# EAGLE design modul_pt100 (EAGLE 7.4.0)

## Sheet 1 of 3
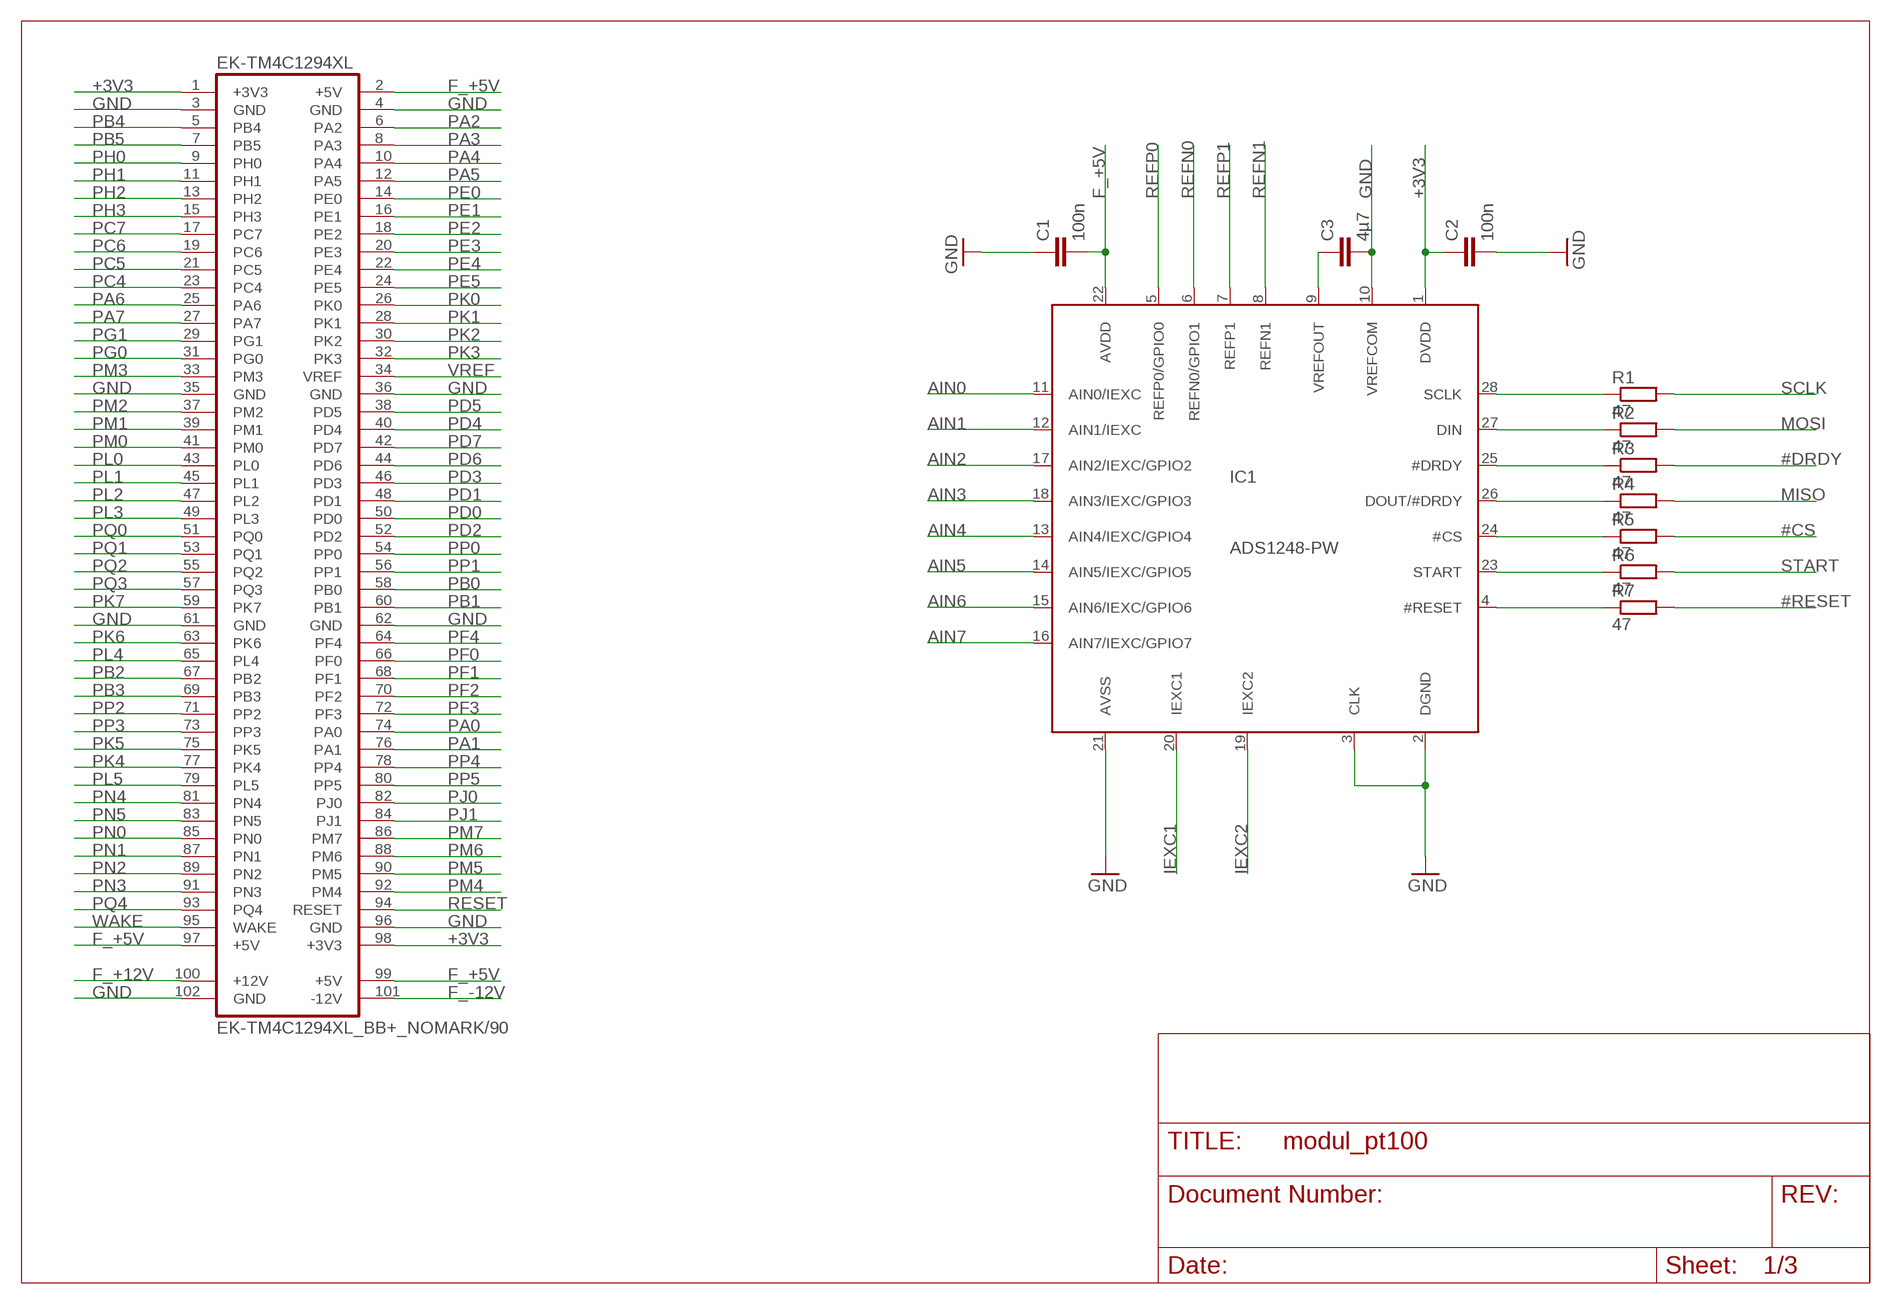
[diagram p0: schematic, sheet 1]

### Parts
C1  100n  C-EUC0805  [C0805]
C2  100n  C-EUC0805  [C0805]
C3  4µ7  C-EUC0805  [C0805]
EK-TM4C1294XL  EK-TM4C1294XL_BB+_NOMARK/90  [EK-TM4C1294XL_BB+_NOMARK/90]
IC1  ADS1248-PW  [TSSOP28]
R1  47  R-EU_R0805  [R0805]
R2  47  R-EU_R0805  [R0805]
R3  47  R-EU_R0805  [R0805]
R4  47  R-EU_R0805  [R0805]
R5  47  R-EU_R0805  [R0805]
R6  47  R-EU_R0805  [R0805]
R7  47  R-EU_R0805  [R0805]

### Nets
#CS: R5.2 ; also sheet 3
#DRDY: R3.2 ; also sheet 3
#RESET: R7.2 ; also sheet 3
+3V3: C2.1 EK-TM4C1294XL.1(+3V3) EK-TM4C1294XL.98(+3V3) IC1.1(DVDD) ; also sheet 3
AIN0: IC1.11(AIN0/IEXC) ; also sheet 2
AIN1: IC1.12(AIN1/IEXC) ; also sheet 2
AIN2: IC1.17(AIN2/IEXC/GPIO2) ; also sheet 2
AIN3: IC1.18(AIN3/IEXC/GPIO3) ; also sheet 2
AIN4: IC1.13(AIN4/IEXC/GPIO4)
AIN5: IC1.14(AIN5/IEXC/GPIO5)
AIN6: IC1.15(AIN6/IEXC/GPIO6)
AIN7: IC1.16(AIN7/IEXC/GPIO7)
F_+5V: C1.2 EK-TM4C1294XL.2(+5V) EK-TM4C1294XL.97(+5V) EK-TM4C1294XL.99(+5V) IC1.22(AVDD) ; also sheet 2,3
F_+12V: EK-TM4C1294XL.100(+12V) ; also sheet 3
F_-12V: EK-TM4C1294XL.101(-12V) ; also sheet 3
GND: C1.1 C2.2 C3.2 EK-TM4C1294XL.3(GND) EK-TM4C1294XL.4(GND) EK-TM4C1294XL.35(GND) EK-TM4C1294XL.36(GND) EK-TM4C1294XL.61(GND) EK-TM4C1294XL.62(GND) EK-TM4C1294XL.96(GND) EK-TM4C1294XL.102(GND) IC1.2(DGND) IC1.3(CLK) IC1.10(VREFCOM) IC1.21(AVSS) ; also sheet 2,3
IEXC1: IC1.20(IEXC1) ; also sheet 2
IEXC2: IC1.19(IEXC2) ; also sheet 2
MISO: R4.2 ; also sheet 2
MOSI: R2.2 ; also sheet 2
N$1: C3.1 IC1.9(VREFOUT)
N$2: IC1.28(SCLK) R1.1
N$3: IC1.27(DIN) R2.1
N$4: IC1.25(#DRDY) R3.1
N$5: IC1.26(DOUT/#DRDY) R4.1
N$6: IC1.24(#CS) R5.1
N$7: IC1.23(START) R6.1
N$8: IC1.4(#RESET) R7.1
PA0: EK-TM4C1294XL.74(PA0) ; also sheet 3
PA1: EK-TM4C1294XL.76(PA1) ; also sheet 3
PA2: EK-TM4C1294XL.6(PA2) ; also sheet 2,3
PA3: EK-TM4C1294XL.8(PA3) ; also sheet 3
PA4: EK-TM4C1294XL.10(PA4) ; also sheet 2,3
PA5: EK-TM4C1294XL.12(PA5) ; also sheet 2,3
PA6: EK-TM4C1294XL.25(PA6) ; also sheet 3
PA7: EK-TM4C1294XL.27(PA7) ; also sheet 3
PB0: EK-TM4C1294XL.58(PB0) ; also sheet 3
PB1: EK-TM4C1294XL.60(PB1) ; also sheet 3
PB2: EK-TM4C1294XL.67(PB2) ; also sheet 3
PB3: EK-TM4C1294XL.69(PB3) ; also sheet 3
PB4: EK-TM4C1294XL.5(PB4) ; also sheet 3
PB5: EK-TM4C1294XL.7(PB5) ; also sheet 2,3
PC4: EK-TM4C1294XL.23(PC4) ; also sheet 3
PC5: EK-TM4C1294XL.21(PC5) ; also sheet 3
PC6: EK-TM4C1294XL.19(PC6) ; also sheet 3
PC7: EK-TM4C1294XL.17(PC7) ; also sheet 3
PD0: EK-TM4C1294XL.50(PD0) ; also sheet 2,3
PD1: EK-TM4C1294XL.48(PD1) ; also sheet 2,3
PD2: EK-TM4C1294XL.52(PD2) ; also sheet 3
PD3: EK-TM4C1294XL.46(PD3) ; also sheet 2,3
PD4: EK-TM4C1294XL.40(PD4) ; also sheet 3
PD5: EK-TM4C1294XL.38(PD5) ; also sheet 3
PD6: EK-TM4C1294XL.44(PD6) ; also sheet 3
PD7: EK-TM4C1294XL.42(PD7) ; also sheet 3
PE0: EK-TM4C1294XL.14(PE0) ; also sheet 3
PE1: EK-TM4C1294XL.16(PE1) ; also sheet 3
PE2: EK-TM4C1294XL.18(PE2) ; also sheet 3
PE3: EK-TM4C1294XL.20(PE3) ; also sheet 3
PE4: EK-TM4C1294XL.22(PE4) ; also sheet 2,3
PE5: EK-TM4C1294XL.24(PE5) ; also sheet 2,3
PF0: EK-TM4C1294XL.66(PF0) ; also sheet 3
PF1: EK-TM4C1294XL.68(PF1) ; also sheet 3
PF2: EK-TM4C1294XL.70(PF2) ; also sheet 3
PF3: EK-TM4C1294XL.72(PF3) ; also sheet 3
PF4: EK-TM4C1294XL.64(PF4) ; also sheet 3
PG0: EK-TM4C1294XL.31(PG0) ; also sheet 3
PG1: EK-TM4C1294XL.29(PG1) ; also sheet 3
PH0: EK-TM4C1294XL.9(PH0) ; also sheet 3
PH1: EK-TM4C1294XL.11(PH1) ; also sheet 3
PH2: EK-TM4C1294XL.13(PH2) ; also sheet 3
PH3: EK-TM4C1294XL.15(PH3) ; also sheet 3
PJ0: EK-TM4C1294XL.82(PJ0) ; also sheet 3
PJ1: EK-TM4C1294XL.84(PJ1) ; also sheet 3
PK0: EK-TM4C1294XL.26(PK0) ; also sheet 3
PK1: EK-TM4C1294XL.28(PK1) ; also sheet 3
PK2: EK-TM4C1294XL.30(PK2) ; also sheet 3
PK3: EK-TM4C1294XL.32(PK3) ; also sheet 3
PK4: EK-TM4C1294XL.77(PK4) ; also sheet 3
PK5: EK-TM4C1294XL.75(PK5) ; also sheet 3
PK6: EK-TM4C1294XL.63(PK6) ; also sheet 3
PK7: EK-TM4C1294XL.59(PK7) ; also sheet 3
PL0: EK-TM4C1294XL.43(PL0) ; also sheet 3
PL1: EK-TM4C1294XL.45(PL1) ; also sheet 3
PL2: EK-TM4C1294XL.47(PL2) ; also sheet 3
PL3: EK-TM4C1294XL.49(PL3) ; also sheet 3
PL4: EK-TM4C1294XL.65(PL4) ; also sheet 3
PL5: EK-TM4C1294XL.79(PL5) ; also sheet 3
PM0: EK-TM4C1294XL.41(PM0) ; also sheet 3
PM1: EK-TM4C1294XL.39(PM1) ; also sheet 3
PM2: EK-TM4C1294XL.37(PM2) ; also sheet 3
PM3: EK-TM4C1294XL.33(PM3) ; also sheet 3
PM4: EK-TM4C1294XL.92(PM4) ; also sheet 3
PM5: EK-TM4C1294XL.90(PM5) ; also sheet 3
PM6: EK-TM4C1294XL.88(PM6) ; also sheet 3
PM7: EK-TM4C1294XL.86(PM7) ; also sheet 3
PN0: EK-TM4C1294XL.85(PN0) ; also sheet 3
PN1: EK-TM4C1294XL.87(PN1) ; also sheet 3
PN2: EK-TM4C1294XL.89(PN2) ; also sheet 3
PN3: EK-TM4C1294XL.91(PN3) ; also sheet 3
PN4: EK-TM4C1294XL.81(PN4) ; also sheet 3
PN5: EK-TM4C1294XL.83(PN5) ; also sheet 3
PP0: EK-TM4C1294XL.54(PP0) ; also sheet 3
PP1: EK-TM4C1294XL.56(PP1) ; also sheet 3
PP2: EK-TM4C1294XL.71(PP2) ; also sheet 3
PP3: EK-TM4C1294XL.73(PP3) ; also sheet 3
PP4: EK-TM4C1294XL.78(PP4) ; also sheet 3
PP5: EK-TM4C1294XL.80(PP5) ; also sheet 3
PQ0: EK-TM4C1294XL.51(PQ0) ; also sheet 2,3
PQ1: EK-TM4C1294XL.53(PQ1) ; also sheet 3
PQ2: EK-TM4C1294XL.55(PQ2) ; also sheet 2,3
PQ3: EK-TM4C1294XL.57(PQ3) ; also sheet 2,3
PQ4: EK-TM4C1294XL.93(PQ4) ; also sheet 3
REFN0: IC1.6(REFN0/GPIO1) ; also sheet 2
REFN1: IC1.8(REFN1) ; also sheet 2
REFP0: IC1.5(REFP0/GPIO0) ; also sheet 2
REFP1: IC1.7(REFP1) ; also sheet 2
RESET: EK-TM4C1294XL.94(RESET) ; also sheet 3
SCLK: R1.2 ; also sheet 2
START: R6.2 ; also sheet 3
VREF: EK-TM4C1294XL.34(VREF) ; also sheet 3
WAKE: EK-TM4C1294XL.95(WAKE) ; also sheet 3

## Sheet 2 of 3
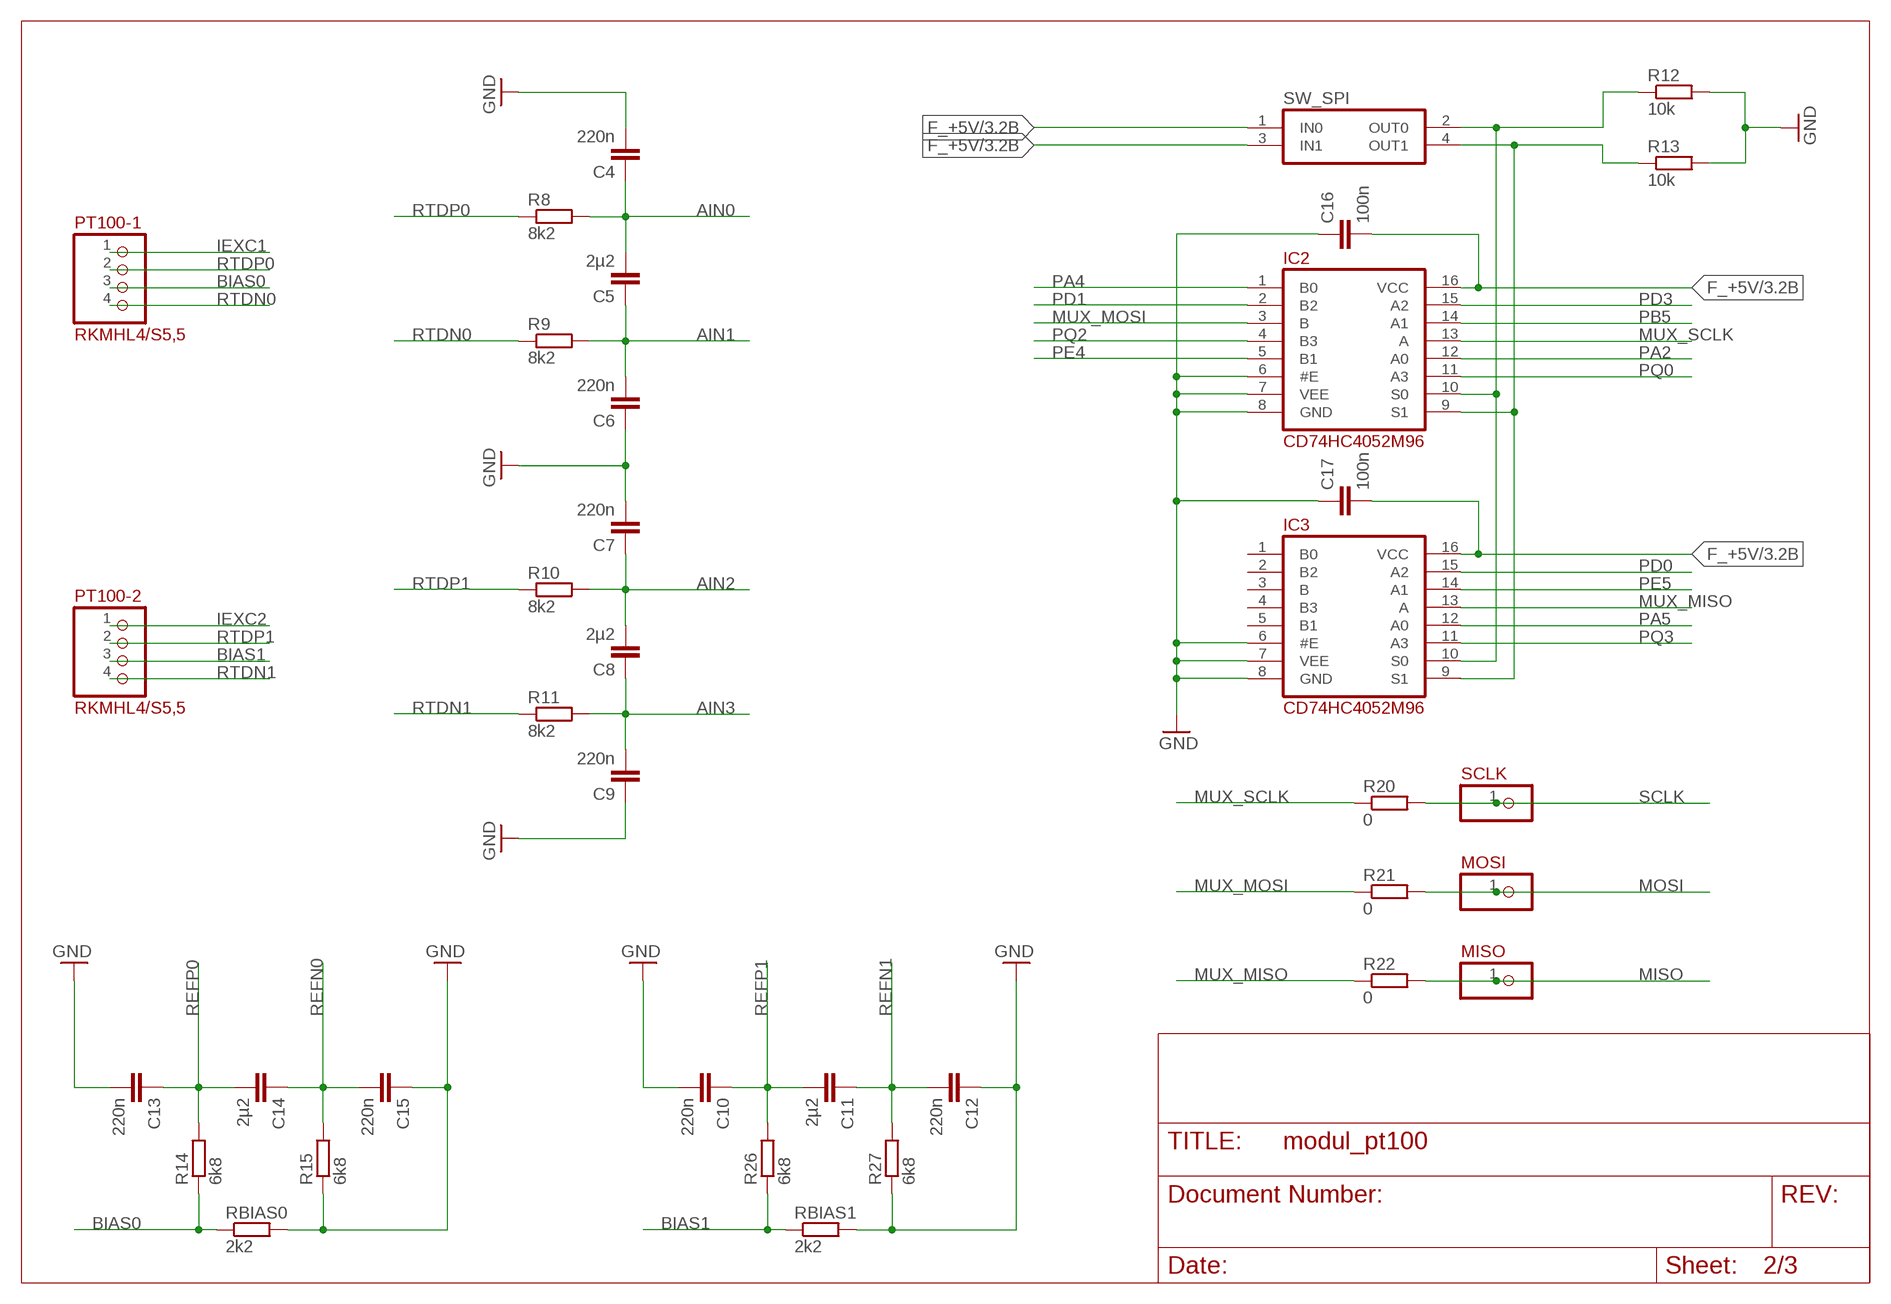
[diagram p1: schematic, sheet 2]

### Parts
C4  220n  C-EUC0805  [C0805]
C5  2µ2  C-EUC0805  [C0805]
C6  220n  C-EUC0805  [C0805]
C7  220n  C-EUC0805  [C0805]
C8  2µ2  C-EUC0805  [C0805]
C9  220n  C-EUC0805  [C0805]
C10  220n  C-EUC0805  [C0805]
C11  2µ2  C-EUC0805  [C0805]
C12  220n  C-EUC0805  [C0805]
C13  220n  C-EUC0805  [C0805]
C14  2µ2  C-EUC0805  [C0805]
C15  220n  C-EUC0805  [C0805]
C16  100n  C-EUC0805  [C0805]
C17  100n  C-EUC0805  [C0805]
IC2  CD74HC4052M96  [SOIC16_D]
IC3  CD74HC4052M96  [SOIC16_D]
MISO  PINH-1X1  [1X1]
MOSI  PINH-1X1  [1X1]
PT100-1  RKMHL4/S5,5  [RKMHL4/S5,5]
PT100-2  RKMHL4/S5,5  [RKMHL4/S5,5]
R8  8k2  R-EU_R0805  [R0805]
R9  8k2  R-EU_R0805  [R0805]
R10  8k2  R-EU_R0805  [R0805]
R11  8k2  R-EU_R0805  [R0805]
R12  10k  R-EU_R0805  [R0805]
R13  10k  R-EU_R0805  [R0805]
R14  6k8  R-EU_R0805  [R0805]
R15  6k8  R-EU_R0805  [R0805]
R20  0  R-EU_R0805  [R0805]
R21  0  R-EU_R0805  [R0805]
R22  0  R-EU_R0805  [R0805]
R26  6k8  R-EU_R0805  [R0805]
R27  6k8  R-EU_R0805  [R0805]
RBIAS0  2k2  R-EU_R0805  [R0805]
RBIAS1  2k2  R-EU_R0805  [R0805]
SCLK  PINH-1X1  [1X1]
SW_SPI  NT02  [NT02]

### Nets
AIN0: C4.1 C5.2 R8.2 ; also sheet 1
AIN1: C5.1 C6.2 R9.2 ; also sheet 1
AIN2: C7.1 C8.2 R10.2 ; also sheet 1
AIN3: C8.1 C9.2 R11.2 ; also sheet 1
BIAS0: PT100-1.3 R14.1 RBIAS0.1
BIAS1: PT100-2.3 R26.1 RBIAS1.1
F_+5V: C16.2 C17.2 IC2.16(VCC) IC3.16(VCC) SW_SPI.1(IN0) SW_SPI.3(IN1) ; also sheet 1,3
GND: C4.2 C6.1 C7.2 C9.1 C10.2 C12.1 C13.2 C15.1 C16.1 C17.1 IC2.6(#E) IC2.7(VEE) IC2.8(GND) IC3.6(#E) IC3.7(VEE) IC3.8(GND) R12.2 R13.2 R15.1 R27.1 RBIAS0.2 RBIAS1.2 ; also sheet 1,3
IEXC1: PT100-1.1 ; also sheet 1
IEXC2: PT100-2.1 ; also sheet 1
MISO: MISO.1 R22.2 ; also sheet 1
MOSI: MOSI.1 R21.2 ; also sheet 1
MUX_MISO: IC3.13(A) R22.1
MUX_MOSI: IC2.3(B) R21.1
MUX_SCLK: IC2.13(A) R20.1
N$16: IC2.10(S0) IC3.10(S0) R12.1 SW_SPI.2(OUT0)
N$17: IC2.9(S1) IC3.9(S1) R13.1 SW_SPI.4(OUT1)
PA2: IC2.12(A0) ; also sheet 1,3
PA4: IC2.1(B0) ; also sheet 1,3
PA5: IC3.12(A0) ; also sheet 1,3
PB5: IC2.14(A1) ; also sheet 1,3
PD0: IC3.15(A2) ; also sheet 1,3
PD1: IC2.2(B2) ; also sheet 1,3
PD3: IC2.15(A2) ; also sheet 1,3
PE4: IC2.5(B1) ; also sheet 1,3
PE5: IC3.14(A1) ; also sheet 1,3
PQ0: IC2.11(A3) ; also sheet 1,3
PQ2: IC2.4(B3) ; also sheet 1,3
PQ3: IC3.11(A3) ; also sheet 1,3
REFN0: C14.1 C15.2 R15.2 ; also sheet 1
REFN1: C11.1 C12.2 R27.2 ; also sheet 1
REFP0: C13.1 C14.2 R14.2 ; also sheet 1
REFP1: C10.1 C11.2 R26.2 ; also sheet 1
RTDN0: PT100-1.4 R9.1
RTDN1: PT100-2.4 R11.1
RTDP0: PT100-1.2 R8.1
RTDP1: PT100-2.2 R10.1
SCLK: R20.2 SCLK.1 ; also sheet 1
Unconnected: IC3.1(B0) IC3.2(B2) IC3.3(B) IC3.4(B3) IC3.5(B1)

## Sheet 3 of 3
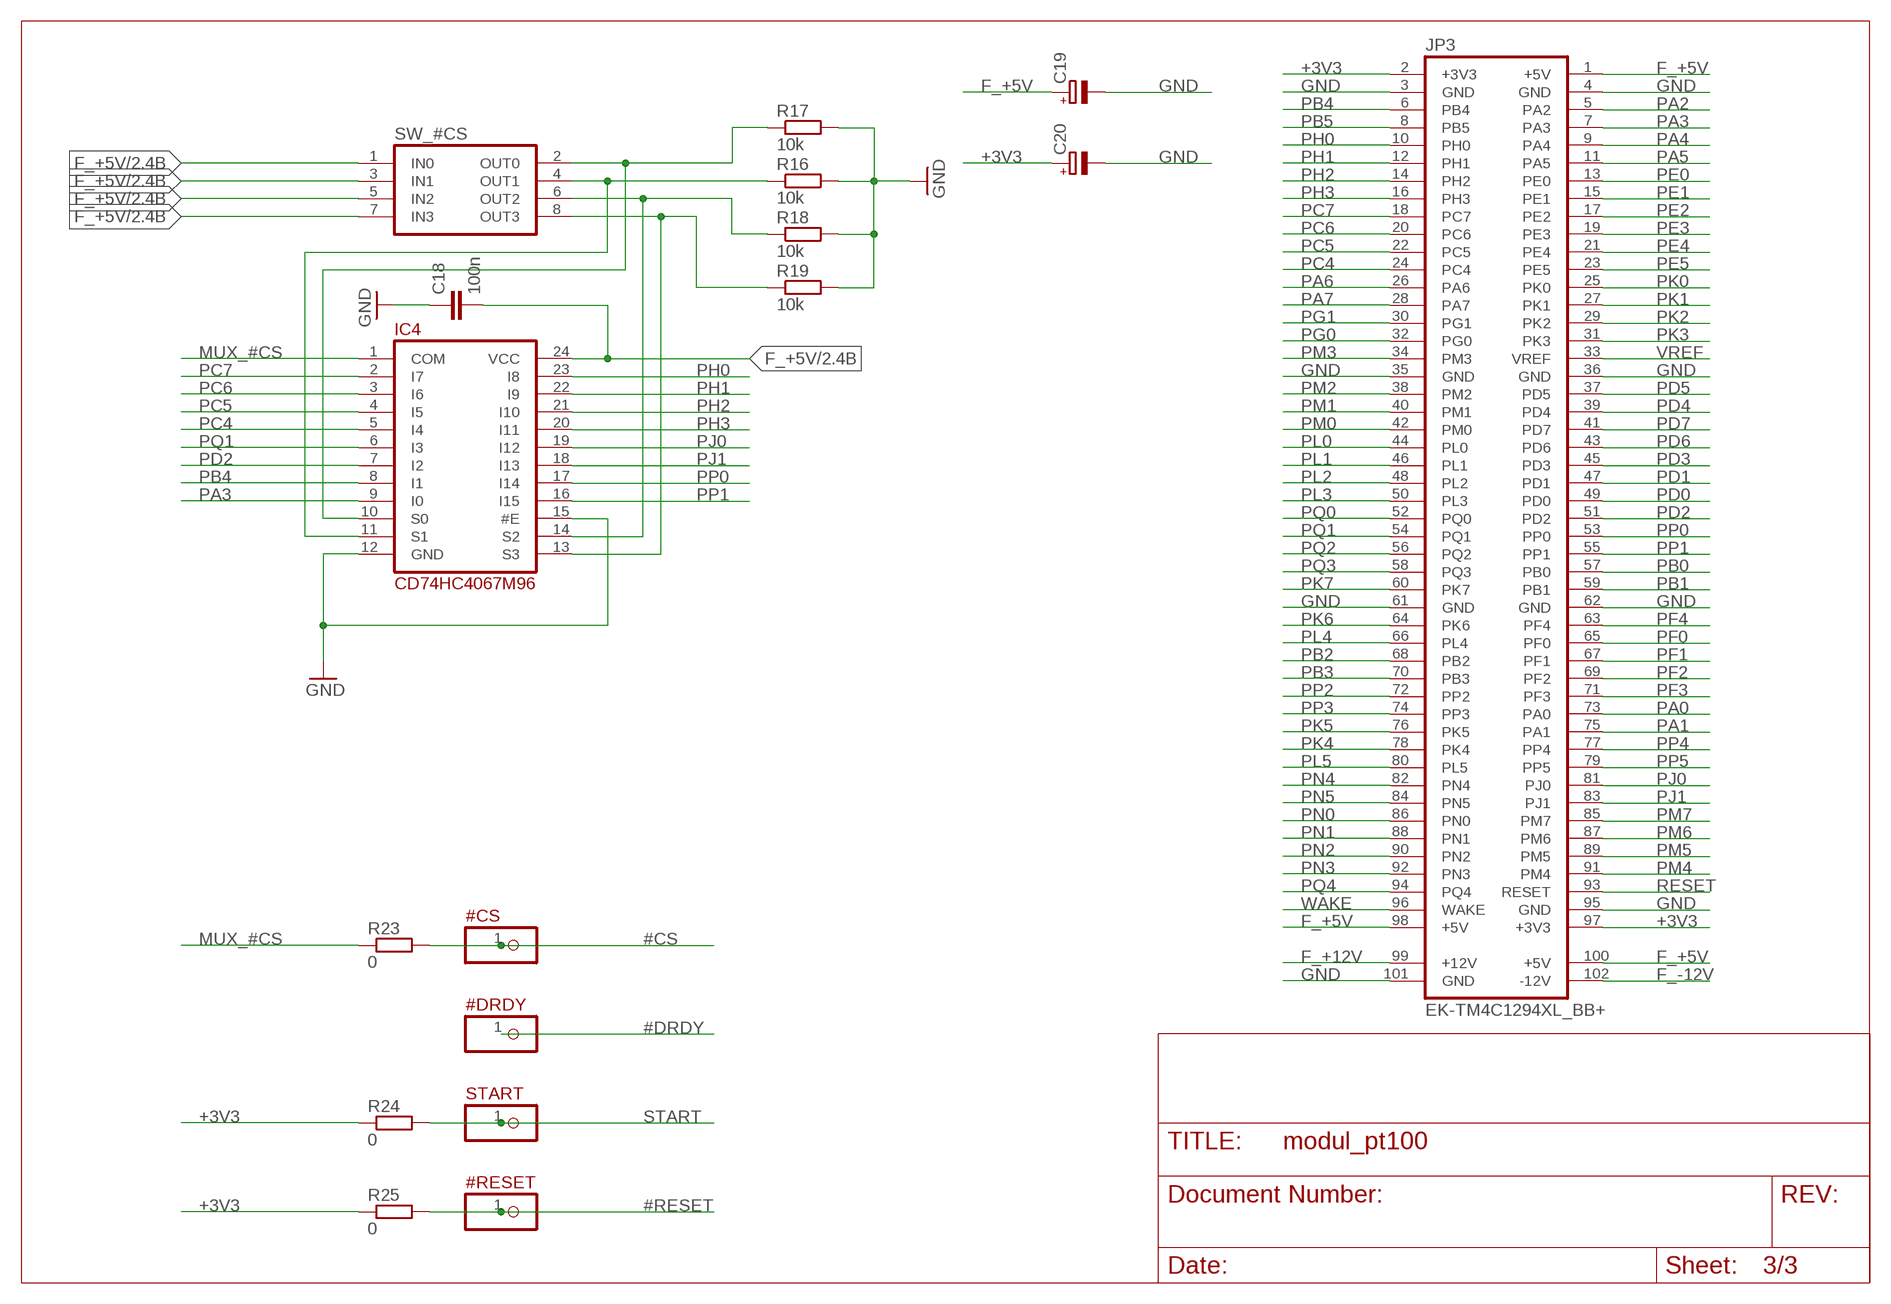
[diagram p2: schematic, sheet 3]

### Parts
#CS  PINH-1X1  [1X1]
#DRDY  PINH-1X1  [1X1]
#RESET  PINH-1X1  [1X1]
C18  100n  C-EUC0805  [C0805]
C19  CPOL-EUE2.5-6  [E2,5-6]
C20  CPOL-EUE2.5-6  [E2,5-6]
IC4  CD74HC4067M96  [SOIC24_DW]
JP3  EK-TM4C1294XL_BB+  [EK-TM4C1294XL_BB+]
R16  10k  R-EU_R0805  [R0805]
R17  10k  R-EU_R0805  [R0805]
R18  10k  R-EU_R0805  [R0805]
R19  10k  R-EU_R0805  [R0805]
R23  0  R-EU_R0805  [R0805]
R24  0  R-EU_R0805  [R0805]
R25  0  R-EU_R0805  [R0805]
START  PINH-1X1  [1X1]
SW_#CS  NT04  [NT04]

### Nets
#CS: #CS.1 R23.2 ; also sheet 1
#DRDY: #DRDY.1 ; also sheet 1
#RESET: #RESET.1 R25.2 ; also sheet 1
+3V3: C20.+ JP3.2(+3V3) JP3.97(+3V3) R24.1 R25.1 ; also sheet 1
F_+5V: C18.2 C19.+ IC4.24(VCC) JP3.1(+5V) JP3.98(+5V) JP3.100(+5V) SW_#CS.1(IN0) SW_#CS.3(IN1) SW_#CS.5(IN2) SW_#CS.7(IN3) ; also sheet 1,2
F_+12V: JP3.99(+12V) ; also sheet 1
F_-12V: JP3.102(-12V) ; also sheet 1
GND: C18.1 C19.- C20.- IC4.12(GND) IC4.15(#E) JP3.3(GND) JP3.4(GND) JP3.35(GND) JP3.36(GND) JP3.61(GND) JP3.62(GND) JP3.95(GND) JP3.101(GND) R16.2 R17.2 R18.2 R19.2 ; also sheet 1,2
MUX_#CS: IC4.1(COM) R23.1
N$10: IC4.11(S1) R16.1 SW_#CS.4(OUT1)
N$12: IC4.10(S0) R17.1 SW_#CS.2(OUT0)
N$18: IC4.14(S2) R18.1 SW_#CS.6(OUT2)
N$24: IC4.13(S3) R19.1 SW_#CS.8(OUT3)
PA0: JP3.73(PA0) ; also sheet 1
PA1: JP3.75(PA1) ; also sheet 1
PA2: JP3.5(PA2) ; also sheet 1,2
PA3: IC4.9(I0) JP3.7(PA3) ; also sheet 1
PA4: JP3.9(PA4) ; also sheet 1,2
PA5: JP3.11(PA5) ; also sheet 1,2
PA6: JP3.26(PA6) ; also sheet 1
PA7: JP3.28(PA7) ; also sheet 1
PB0: JP3.57(PB0) ; also sheet 1
PB1: JP3.59(PB1) ; also sheet 1
PB2: JP3.68(PB2) ; also sheet 1
PB3: JP3.70(PB3) ; also sheet 1
PB4: IC4.8(I1) JP3.6(PB4) ; also sheet 1
PB5: JP3.8(PB5) ; also sheet 1,2
PC4: IC4.5(I4) JP3.24(PC4) ; also sheet 1
PC5: IC4.4(I5) JP3.22(PC5) ; also sheet 1
PC6: IC4.3(I6) JP3.20(PC6) ; also sheet 1
PC7: IC4.2(I7) JP3.18(PC7) ; also sheet 1
PD0: JP3.49(PD0) ; also sheet 1,2
PD1: JP3.47(PD1) ; also sheet 1,2
PD2: IC4.7(I2) JP3.51(PD2) ; also sheet 1
PD3: JP3.45(PD3) ; also sheet 1,2
PD4: JP3.39(PD4) ; also sheet 1
PD5: JP3.37(PD5) ; also sheet 1
PD6: JP3.43(PD6) ; also sheet 1
PD7: JP3.41(PD7) ; also sheet 1
PE0: JP3.13(PE0) ; also sheet 1
PE1: JP3.15(PE1) ; also sheet 1
PE2: JP3.17(PE2) ; also sheet 1
PE3: JP3.19(PE3) ; also sheet 1
PE4: JP3.21(PE4) ; also sheet 1,2
PE5: JP3.23(PE5) ; also sheet 1,2
PF0: JP3.65(PF0) ; also sheet 1
PF1: JP3.67(PF1) ; also sheet 1
PF2: JP3.69(PF2) ; also sheet 1
PF3: JP3.71(PF3) ; also sheet 1
PF4: JP3.63(PF4) ; also sheet 1
PG0: JP3.32(PG0) ; also sheet 1
PG1: JP3.30(PG1) ; also sheet 1
PH0: IC4.23(I8) JP3.10(PH0) ; also sheet 1
PH1: IC4.22(I9) JP3.12(PH1) ; also sheet 1
PH2: IC4.21(I10) JP3.14(PH2) ; also sheet 1
PH3: IC4.20(I11) JP3.16(PH3) ; also sheet 1
PJ0: IC4.19(I12) JP3.81(PJ0) ; also sheet 1
PJ1: IC4.18(I13) JP3.83(PJ1) ; also sheet 1
PK0: JP3.25(PK0) ; also sheet 1
PK1: JP3.27(PK1) ; also sheet 1
PK2: JP3.29(PK2) ; also sheet 1
PK3: JP3.31(PK3) ; also sheet 1
PK4: JP3.78(PK4) ; also sheet 1
PK5: JP3.76(PK5) ; also sheet 1
PK6: JP3.64(PK6) ; also sheet 1
PK7: JP3.60(PK7) ; also sheet 1
PL0: JP3.44(PL0) ; also sheet 1
PL1: JP3.46(PL1) ; also sheet 1
PL2: JP3.48(PL2) ; also sheet 1
PL3: JP3.50(PL3) ; also sheet 1
PL4: JP3.66(PL4) ; also sheet 1
PL5: JP3.80(PL5) ; also sheet 1
PM0: JP3.42(PM0) ; also sheet 1
PM1: JP3.40(PM1) ; also sheet 1
PM2: JP3.38(PM2) ; also sheet 1
PM3: JP3.34(PM3) ; also sheet 1
PM4: JP3.91(PM4) ; also sheet 1
PM5: JP3.89(PM5) ; also sheet 1
PM6: JP3.87(PM6) ; also sheet 1
PM7: JP3.85(PM7) ; also sheet 1
PN0: JP3.86(PN0) ; also sheet 1
PN1: JP3.88(PN1) ; also sheet 1
PN2: JP3.90(PN2) ; also sheet 1
PN3: JP3.92(PN3) ; also sheet 1
PN4: JP3.82(PN4) ; also sheet 1
PN5: JP3.84(PN5) ; also sheet 1
PP0: IC4.17(I14) JP3.53(PP0) ; also sheet 1
PP1: IC4.16(I15) JP3.55(PP1) ; also sheet 1
PP2: JP3.72(PP2) ; also sheet 1
PP3: JP3.74(PP3) ; also sheet 1
PP4: JP3.77(PP4) ; also sheet 1
PP5: JP3.79(PP5) ; also sheet 1
PQ0: JP3.52(PQ0) ; also sheet 1,2
PQ1: IC4.6(I3) JP3.54(PQ1) ; also sheet 1
PQ2: JP3.56(PQ2) ; also sheet 1,2
PQ3: JP3.58(PQ3) ; also sheet 1,2
PQ4: JP3.94(PQ4) ; also sheet 1
RESET: JP3.93(RESET) ; also sheet 1
START: R24.2 START.1 ; also sheet 1
VREF: JP3.33(VREF) ; also sheet 1
WAKE: JP3.96(WAKE) ; also sheet 1

## Library data of the parts
#CS #DRDY #RESET MISO MOSI SCLK START = ownparts:PINH-1X1*: 1x1 pol. Stiftleisten, RM 2.54
C1-C18 = rcl:C-EU: CAPACITOR, European symbol
C19 C20 = rcl:CPOL-EU: POLARIZED CAPACITOR, European symbol
EK-TM4C1294XL JP3 = ownparts:EK-TM4C1294XL_BB+
IC1 = ADS1248:ADS1248
IC2 IC3 = ownparts:CD74HC4052*
IC4 = ownparts:CD74HC4067*
PT100-1 PT100-2 = ownparts:RKMHL4/S5,5
R1-R27 RBIAS0 RBIAS1 = rcl:R-EU_: RESISTOR, European symbol
SW_#CS = ownparts:NT04
SW_SPI = ownparts:NT02

## Board
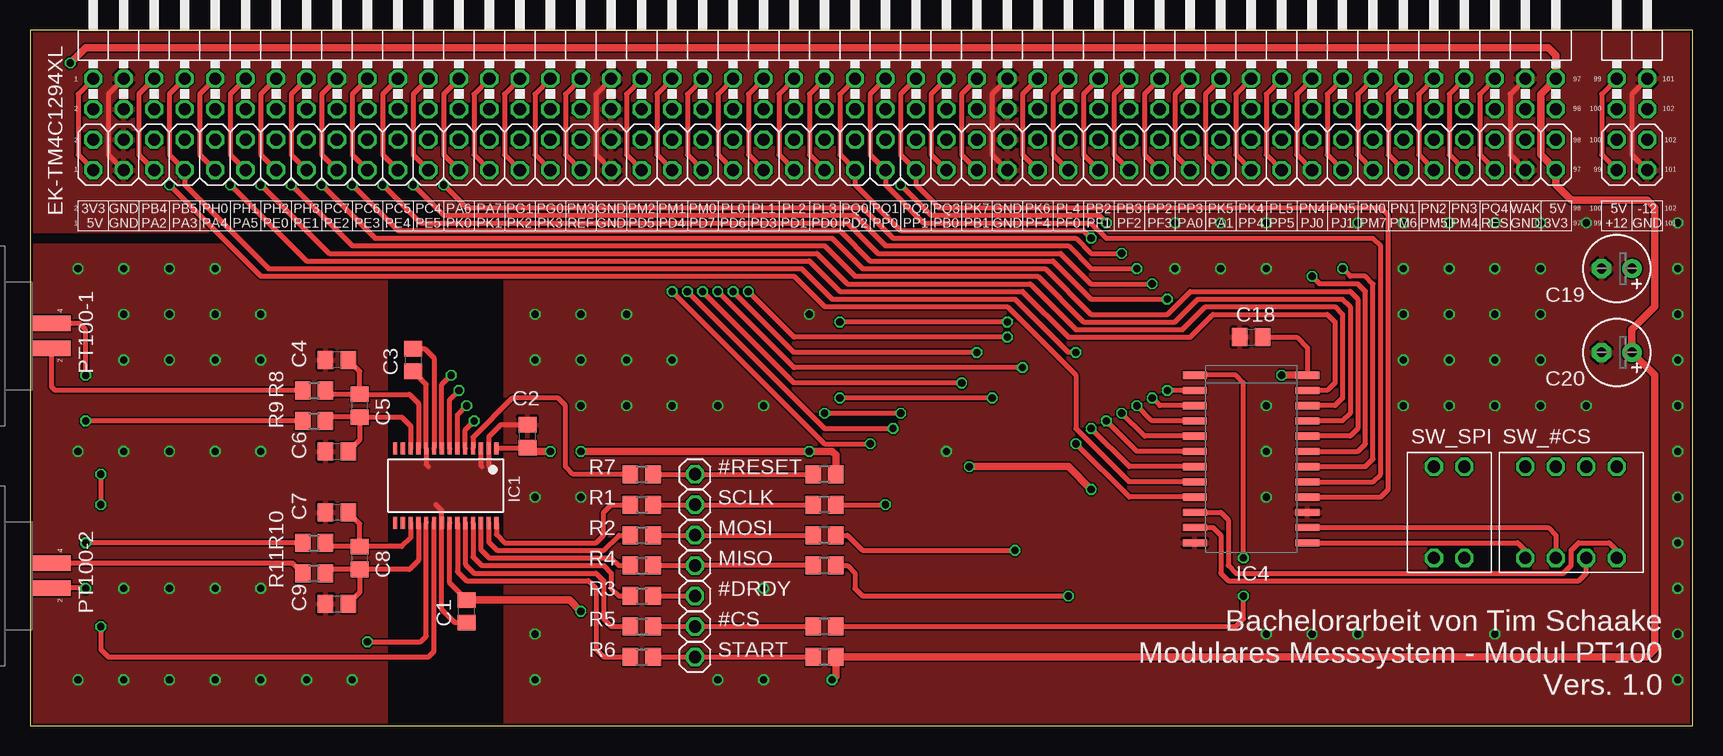
[diagram p3: board, top side]
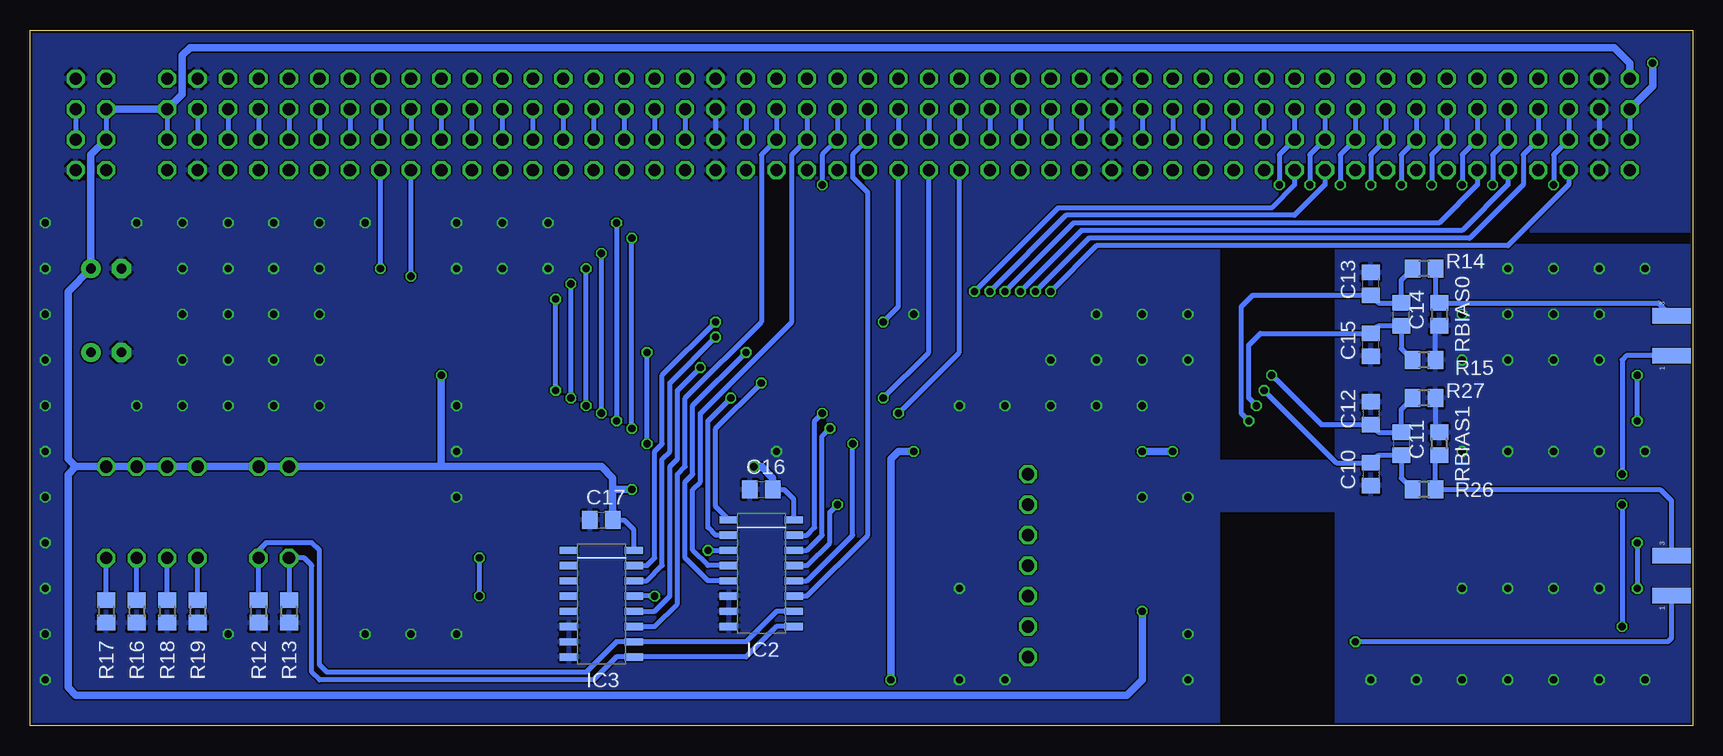
[diagram p4: board, bottom side, seen from below]

Size 138.62 x 58 mm. Coordinates in mm from the lower left corner, seen from the top.
Outline: 0,0 138.62,0 138.62,58 0,58 0,0
Copper layers (1*16): Top 0.018mm / dielectric 1.55mm / Bottom 0.018mm
Design rules "Multi-CB_2L_125um-Tracks_OL35um": minimum track width 0.125mm, minimum drill 0.2mm, track to track 0.125mm, track to pad 0.125mm, pad to pad 0.125mm, via to via 0.125mm, smd to smd 0mil, copper to edge 0.2mm, drill to drill 0.2mm, minimum pad ring 0.125mm, minimum via ring 0.125mm, stop-mask expansion 2mil, vias tented up to drill 0.45mm, thermal gap 0.2mm

### Footprints (pad centres in the part's own frame; a part is rotated, then mirrored left to right if it is on the bottom)
1X1 = drill 1.016 octagon: 1 0,0
C0805 = smd 1.3 x 1.5: 1 -0.95,0; 2 0.95,0
E2,5-6 = drill 0.813 pad 1.6: + -1.27,0 | drill 0.813 pad 1.6 octagon: - 1.27,0
EK-TM4C1294XL_BB+_NOMARK/90 = drill 1.016 octagon: 1 -60.96,-1.27; 2 -60.96,1.27; 3 -58.42,-1.27; 4 -58.42,1.27; 5 -55.88,-1.27; 6 -55.88,1.27; 7 -53.34,-1.27; 8 -53.34,1.27; 9 -50.8,-1.27; 10 -50.8,1.27; 11 -48.26,-1.27; 12 -48.26,1.27; 13 -45.72,-1.27; 14 -45.72,1.27; 15 -43.18,-1.27; 16 -43.18,1.27; 17 -40.64,-1.27; 18 -40.64,1.27; 19 -38.1,-1.27; 20 -38.1,1.27; 21 -35.56,-1.27; 22 -35.56,1.27; 23 -33.02,-1.27; 24 -33.02,1.27; 25 -30.48,-1.27; 26 -30.48,1.27; 27 -27.94,-1.27; 28 -27.94,1.27; 29 -25.4,-1.27; 30 -25.4,1.27; 31 -22.86,-1.27; 32 -22.86,1.27; 33 -20.32,-1.27; 34 -20.32,1.27; 35 -17.78,-1.27; 36 -17.78,1.27; 37 -15.24,-1.27; 38 -15.24,1.27; 39 -12.7,-1.27; 40 -12.7,1.27; 41 -10.16,-1.27; 42 -10.16,1.27; 43 -7.62,-1.27; 44 -7.62,1.27; 45 -5.08,-1.27; 46 -5.08,1.27; 47 -2.54,-1.27; 48 -2.54,1.27; 49 0,-1.27; 50 0,1.27; 51 2.54,-1.27; 52 2.54,1.27; 53 5.08,-1.27; 54 5.08,1.27; 55 7.62,-1.27; 56 7.62,1.27; 57 10.16,-1.27; 58 10.16,1.27; 59 12.7,-1.27; 60 12.7,1.27; 61 15.24,-1.27; 62 15.24,1.27; 63 17.78,-1.27; 64 17.78,1.27; 65 20.32,-1.27; 66 20.32,1.27; 67 22.86,-1.27; 68 22.86,1.27; 69 25.4,-1.27; 70 25.4,1.27; 71 27.94,-1.27; 72 27.94,1.27; 73 30.48,-1.27; 74 30.48,1.27; 75 33.02,-1.27; 76 33.02,1.27; 77 35.56,-1.27; 78 35.56,1.27; 79 38.1,-1.27; 80 38.1,1.27; 81 40.64,-1.27; 82 40.64,1.27; 83 43.18,-1.27; 84 43.18,1.27; 85 45.72,-1.27; 86 45.72,1.27; 87 48.26,-1.27; 88 48.26,1.27; 89 50.8,-1.27; 90 50.8,1.27; 91 53.34,-1.27; 92 53.34,1.27; 93 55.88,-1.27; 94 55.88,1.27; 95 58.42,-1.27; 96 58.42,1.27; 97 60.96,-1.27; 98 60.96,1.27; 99 66.04,-1.27; 100 66.04,1.27; 101 68.58,-1.27; 102 68.58,1.27
TSSOP28 = smd 0.35 x 1: 1 -4.225,-3.087; 2 -3.575,-3.087; 3 -2.925,-3.087; 4 -2.275,-3.087; 5 -1.625,-3.087; 6 -0.975,-3.087; 7 -0.325,-3.087; 8 0.325,-3.087; 9 0.975,-3.087; 10 1.625,-3.087; 11 2.275,-3.087; 12 2.925,-3.087; 13 3.575,-3.087; 14 4.225,-3.087; 15 4.225,3.087; 16 3.575,3.087; 17 2.925,3.087; 18 2.275,3.087; 19 1.625,3.087; 20 0.975,3.087; 21 0.325,3.087; 22 -0.325,3.087; 23 -0.975,3.087; 24 -1.625,3.087; 25 -2.275,3.087; 26 -2.925,3.087; 27 -3.575,3.087; 28 -4.225,3.087
SOIC16_D = smd 0.6 x 1.55: 1 -4.445,-2.7; 2 -3.175,-2.7; 3 -1.905,-2.7; 4 -0.635,-2.7; 5 0.635,-2.7; 6 1.905,-2.7; 7 3.175,-2.7; 8 4.445,-2.7; 9 4.445,2.7; 10 3.175,2.7; 11 1.905,2.7; 12 0.635,2.7; 13 -0.635,2.7; 14 -1.905,2.7; 15 -3.175,2.7; 16 -4.445,2.7
SOIC24_DW = smd 0.6 x 2: 1 -6.985,-4.7; 2 -5.715,-4.7; 3 -4.445,-4.7; 4 -3.175,-4.7; 5 -1.905,-4.7; 6 -0.635,-4.7; 7 0.635,-4.7; 8 1.905,-4.7; 9 3.175,-4.7; 10 4.445,-4.7; 11 5.715,-4.7; 12 6.985,-4.7; 13 6.985,4.7; 14 5.715,4.7; 15 4.445,4.7; 16 3.175,4.7; 17 1.905,4.7; 18 0.635,4.7; 19 -0.635,4.7; 20 -1.905,4.7; 21 -3.175,4.7; 22 -4.445,4.7; 23 -5.715,4.7; 24 -6.985,4.7
EK-TM4C1294XL_BB+ = drill 1.016 octagon: 1 -60.96,-1.27; 2 -60.96,1.27; 3 -58.42,-1.27; 4 -58.42,1.27; 5 -55.88,-1.27; 6 -55.88,1.27; 7 -53.34,-1.27; 8 -53.34,1.27; 9 -50.8,-1.27; 10 -50.8,1.27; 11 -48.26,-1.27; 12 -48.26,1.27; 13 -45.72,-1.27; 14 -45.72,1.27; 15 -43.18,-1.27; 16 -43.18,1.27; 17 -40.64,-1.27; 18 -40.64,1.27; 19 -38.1,-1.27; 20 -38.1,1.27; 21 -35.56,-1.27; 22 -35.56,1.27; 23 -33.02,-1.27; 24 -33.02,1.27; 25 -30.48,-1.27; 26 -30.48,1.27; 27 -27.94,-1.27; 28 -27.94,1.27; 29 -25.4,-1.27; 30 -25.4,1.27; 31 -22.86,-1.27; 32 -22.86,1.27; 33 -20.32,-1.27; 34 -20.32,1.27; 35 -17.78,-1.27; 36 -17.78,1.27; 37 -15.24,-1.27; 38 -15.24,1.27; 39 -12.7,-1.27; 40 -12.7,1.27; 41 -10.16,-1.27; 42 -10.16,1.27; 43 -7.62,-1.27; 44 -7.62,1.27; 45 -5.08,-1.27; 46 -5.08,1.27; 47 -2.54,-1.27; 48 -2.54,1.27; 49 0,-1.27; 50 0,1.27; 51 2.54,-1.27; 52 2.54,1.27; 53 5.08,-1.27; 54 5.08,1.27; 55 7.62,-1.27; 56 7.62,1.27; 57 10.16,-1.27; 58 10.16,1.27; 59 12.7,-1.27; 60 12.7,1.27; 61 15.24,-1.27; 62 15.24,1.27; 63 17.78,-1.27; 64 17.78,1.27; 65 20.32,-1.27; 66 20.32,1.27; 67 22.86,-1.27; 68 22.86,1.27; 69 25.4,-1.27; 70 25.4,1.27; 71 27.94,-1.27; 72 27.94,1.27; 73 30.48,-1.27; 74 30.48,1.27; 75 33.02,-1.27; 76 33.02,1.27; 77 35.56,-1.27; 78 35.56,1.27; 79 38.1,-1.27; 80 38.1,1.27; 81 40.64,-1.27; 82 40.64,1.27; 83 43.18,-1.27; 84 43.18,1.27; 85 45.72,-1.27; 86 45.72,1.27; 87 48.26,-1.27; 88 48.26,1.27; 89 50.8,-1.27; 90 50.8,1.27; 91 53.34,-1.27; 92 53.34,1.27; 93 55.88,-1.27; 94 55.88,1.27; 95 58.42,-1.27; 96 58.42,1.27; 97 60.96,-1.27; 98 60.96,1.27; 99 66.04,-1.27; 100 66.04,1.27; 101 68.58,-1.27; 102 68.58,1.27
RKMHL4/S5,5 = smd 1.3 x 3.2 bottom: 1 -1.66,-1.6; 3 1.66,-1.6 | smd 1.3 x 3.2: 2 -1.03,-1.6; 4 1.03,-1.6
R0805 = smd 1.3 x 1.5: 1 -0.95,0; 2 0.95,0
NT04 = drill 1.016 octagon: 1 -3.81,-3.81; 2 -3.81,3.81; 3 -1.27,-3.81; 4 -1.27,3.81; 5 1.27,-3.81; 6 1.27,3.81; 7 3.81,-3.81; 8 3.81,3.81
NT02 = drill 1.016 octagon: 1 -1.27,-3.81; 2 -1.27,3.81; 3 1.27,-3.81; 4 1.27,3.81

### Placement (x,y rotation side)
#CS  55.44,8.26 0 top
#DRDY  55.44,10.79 0 top
#RESET  55.44,20.95 0 top
C1  36.38,9.53 90 top
C2  41.47,24.13 90 top
C3  31.94,30.48 270 top
C4  25.59,30.48 180 top
C5  27.5,26.67 90 top
C6  25.59,22.86 0 top
C7  25.59,17.78 180 top
C8  27.5,13.97 90 top
C9  25.59,10.16 0 top
C10  26.86,20.95 270 bottom
C11  24.32,23.5 270 bottom
C12  26.86,26.04 270 bottom
C13  26.86,36.83 90 bottom
C14  24.32,34.29 90 bottom
C15  26.86,31.75 90 bottom
C16  77.66,19.68 0 bottom
C17  91,17.14 0 bottom
C18  101.79,32.38 0 top
C19  132.27,38.1 180 top
C20  132.27,31.11 180 top
EK-TM4C1294XL  66.23,52.67 0 top
IC1  34.66,20 180 top
IC2  77.66,12.7 270 bottom
IC3  91,10.16 270 bottom
IC4  101.79,22.23 270 top
JP3  66.23,47.59 0 top
MISO  55.44,13.34 0 top
MOSI  55.44,15.88 0 top
PT100-1  0.2,32.5 90 top
PT100-2  0.2,12.5 90 top
R1  50.99,18.41 0 top
R2  50.99,15.88 0 top
R3  50.99,10.79 0 top
R4  50.99,13.34 0 top
R5  50.99,8.26 0 top
R6  50.99,5.71 0 top
R7  50.99,20.95 0 top
R8  23.68,27.94 0 top
R9  23.68,25.4 0 top
R10  23.68,15.24 0 top
R11  23.68,12.7 0 top
R12  119.57,9.53 270 bottom
R13  117.03,9.53 270 bottom
R14  22.41,38.1 180 bottom
R15  22.41,30.48 180 bottom
R16  129.73,9.53 270 bottom
R17  132.27,9.53 270 bottom
R18  127.19,9.53 270 bottom
R19  124.65,9.53 270 bottom
R20  66.23,18.41 180 top
R21  66.23,15.88 180 top
R22  66.23,13.34 180 top
R23  66.23,8.26 180 top
R24  66.23,5.71 180 top
R25  66.23,20.95 180 top
R26  22.41,19.68 180 bottom
R27  22.41,27.3 180 bottom
RBIAS0  21.14,34.29 270 bottom
RBIAS1  21.14,23.5 90 bottom
SCLK  55.44,18.41 0 top
START  55.44,5.71 0 top
SW_#CS  128.46,17.78 180 top
SW_SPI  118.3,17.78 180 top

### Tracks (layer width: path | path; a pad name or v marks a point on that pad's centre or on a via)
#CS
  Top 0.406: R5.2 #CS.1 R23.2
#DRDY
  Top 0.406: R3.2 #DRDY.1
#RESET
  Top 0.406: R7.2 #RESET.1 R25.2
+3V3  (via drill 0.6)
  Top 0.406: C2.1 41.37,23.09 IC1.1
  Top 0.61: v3.37,55.24 4.63,56.52 126.56,56.52 127.19,55.88 EK-TM4C1294XL.98 125.92,52.67 125.92,47.59 JP3.97 127.19,45.09 128.46,43.81 134.81,43.81 135.44,43.18 135.44,34.92 133.54,33.02 C20.+ 135.44,29.21 135.44,6.35 134.81,5.71 R24.1 67.18,4.12 v66.87,3.81 | v64.96,22.86 65.28,22.86 | v64.96,22.86 v45.91,22.86 | v43.37,22.86 41.78,22.86 C2.1 | R25.1 67.18,22.55 66.87,22.86 v64.96,22.86
  Bottom 0.406: EK-TM4C1294XL.1 JP3.2
  Bottom 0.61: EK-TM4C1294XL.1 3.37,53.3 v3.37,55.24 | v66.87,3.81 66.87,22.23 66.23,22.86 v64.96,22.86 | v45.91,22.86 v43.37,22.86
AIN0
  Top 0.406: C5.2 31.62,27.62 32.38,26.86 IC1.11 | C5.2 24.95,27.62 R8.2 | C5.2 27.5,29.52 C4.1
AIN1
  Top 0.406: C5.1 30.98,25.72 31.73,24.98 IC1.12 | C5.1 24.95,25.72 R9.2 | C5.1 27.5,23.82 C6.2
AIN2
  Top 0.406: IC1.17 31.73,15.66 30.98,14.92 C8.2 | C8.2 24.95,14.92 R10.2 | C8.2 27.5,16.82 C7.1
AIN3
  Top 0.406: IC1.18 32.38,13.78 31.62,13.02 C8.1 | C8.1 24.95,13.02 R11.2 | C8.1 27.5,11.12 C9.2
BIAS0
  Bottom 0.406: R14.1 21.46,35.56 RBIAS0.1 2.88,35.24 PT100-1.3
BIAS1
  Bottom 0.406: RBIAS1.1 21.46,22.23 R26.1 2.73,19.68 1.8,18.75 PT100-2.3
F_+5V  (via drill 0.6)
  Top 0.406: IC1.22 34.98,11.88 C1.2 | EK-TM4C1294XL.2 4,52.67 4,47.59 JP3.1 | C18.2 105.6,32.38 106.49,31.5 IC4.24
  Top 0.61: v104.33,29.21 IC4.24 | v88.45,19.68 86.55,21.59 v78.3,21.59 | v45.91,9.53 44.96,10.47 C1.2
  Bottom 0.406: C16.2 75.75,19.68 74.96,18.89 IC2.16 75.12,17.3 | C17.2 89.09,17.14 88.3,16.35 IC3.16 | EK-TM4C1294XL.97 JP3.98 | EK-TM4C1294XL.99 JP3.100
  Bottom 0.61: EK-TM4C1294XL.2 5.27,55.24 6.54,56.52 125.28,56.52 125.92,55.88 125.92,52.67 EK-TM4C1294XL.97 EK-TM4C1294XL.99 | JP3.100 133.54,47.59 C19.+ 135.44,36.2 135.44,22.23 134.81,21.59 | 104.33,21.59 SW_SPI.3 SW_SPI.1 SW_#CS.7 SW_#CS.5 SW_#CS.3 SW_#CS.1 134.81,21.59 | 104.33,21.59 91,21.59 90.05,20.64 90.05,19.68 | 90.05,19.68 C17.2 | 104.33,21.59 v104.33,29.21 | 90.05,19.68 v88.45,19.68 | v78.3,21.59 77.66,21.59 76.71,20.64 C16.2 | v45.91,9.53 45.91,3.81 47.18,2.54 134.81,2.54 135.44,3.17 135.44,20.95 134.81,21.59
F_+12V
  Top 0.406: EK-TM4C1294XL.100 131,52.67 131,47.59 JP3.99
F_-12V
  Bottom 0.406: EK-TM4C1294XL.101 JP3.102
GND  (via drill 0.6)
  Top 0.406: 33.21,21.59 33.03,21.77 IC1.10 33.03,28.44 C3.2 | 33.84,18.41 34.33,17.93 IC1.21 34.33,9.68 35.43,8.57 C1.1 | 38.29,21.59 38.23,21.65 IC1.2 38.23,24.07 39.24,25.08 C2.2 | IC1.3 37.58,21.66 37.66,21.59 | EK-TM4C1294XL.4 6.54,52.67 6.54,47.59 JP3.3 | EK-TM4C1294XL.36 47.18,52.67 47.18,47.59 JP3.35 | EK-TM4C1294XL.62 80.2,52.67 80.2,47.59 JP3.61 | EK-TM4C1294XL.96 123.38,52.67 123.38,47.59 JP3.95 | EK-TM4C1294XL.102 133.54,52.67 133.54,47.59 JP3.101
  Bottom 0.406: R15.1 21.46,33.02 RBIAS0.2 | R27.1 21.46,24.77 RBIAS1.2 | EK-TM4C1294XL.3 JP3.4 | EK-TM4C1294XL.35 JP3.36 | EK-TM4C1294XL.61 JP3.62
  other vias: 129.73,26.67 125.92,26.67 122.11,26.67 118.3,26.67 118.3,30.48 122.11,30.48 125.92,30.48 122.11,34.29 118.3,34.29 122.11,38.1 118.3,38.1 110.68,7.62 106.87,7.62 103.06,7.62 61.15,26.67 57.34,26.67 53.53,26.67 49.72,26.67 45.91,26.67 45.91,30.48 42.1,30.48 42.1,34.29 45.91,34.29 49.72,34.29 53.53,30.48 49.72,30.48 61.15,11.43 42.1,7.62 42.1,3.81 26.86,3.81 23.05,3.81 19.24,3.81 15.43,3.81 11.62,3.81 7.81,3.81 4,3.81 7.81,11.43 11.62,11.43 15.43,11.43 19.24,11.43 19.24,22.86 15.43,22.86 11.62,22.86 7.81,22.86 4,22.86 7.81,30.48 11.62,30.48 15.43,30.48 7.81,34.29 11.62,34.29 15.43,34.29 19.24,34.29 19.24,30.48 15.43,38.1 11.62,38.1 7.81,38.1 4,38.1 45.91,19.05 42.1,19.05 103.06,38.1 99.25,38.1 95.44,38.1 95.44,41.91 99.25,41.91 103.06,41.91 110.68,41.91 64.96,34.29 76.39,22.86 118.3,41.91 122.11,41.91 125.92,41.91 129.73,41.91 114.49,26.67 114.49,30.48 114.49,34.29 114.49,38.1 114.49,41.91 122.11,7.62 103.06,19.05 103.06,26.67 103.06,22.86 61.15,3.81 57.34,3.81 125.92,34.29 125.92,38.1 137.35,41.91 137.35,38.1 137.35,34.29 137.35,30.48 137.35,26.67 137.35,22.86 137.35,19.05 137.35,15.24 137.35,11.43 137.35,7.62 137.35,3.81
  pour Top: 0,0 29.66,0 29.66,18 39.66,18 39.66,0 138.62,0 138.62,58 0,58 0,41.27 39.66,41.27 39.66,22 29.66,22 29.66,40 0,40
  pour Bottom: 0,0 29.66,0 29.66,18 39.66,18 39.66,0 138.62,0 138.62,58 0,58 0,41.27 39.66,41.27 39.66,22 29.66,22 29.66,40 0,40
IEXC1  (via drill 0.6)
  Top 0.406: v5.91,20.95 v5.91,18.41 | v5.91,8.26 5.91,6.35 6.54,5.71 33.21,5.71 33.68,6.18 IC1.20
  Bottom 0.406: PT100-1.1 5.54,30.84 5.91,30.48 v5.91,20.95 | v5.91,18.41 v5.91,8.26
IEXC2  (via drill 0.6)
  Top 0.406: v28.13,6.99 32.58,6.99 33.03,7.44 IC1.19
  Bottom 0.406: PT100-2.1 1.8,7.28 2.09,6.99 v28.13,6.99
MISO
  Top 0.406: R4.2 MISO.1 R22.2
MOSI
  Top 0.406: R2.2 MOSI.1 R21.2
MUX_#CS  (via drill 0.6)
  Top 0.406: R23.1 100.52,8.26 101.16,8.89 v101.16,10.79 | v101.16,13.97 101.16,28.57 100.52,29.21 IC4.1
  Bottom 0.406: v101.16,10.79 v101.16,13.97
MUX_MISO  (via drill 0.6)
  Top 0.406: R22.1 68.14,13.34 68.77,12.7 68.77,11.43 69.41,10.79 v86.55,10.79
  Bottom 0.406: v86.55,10.79 IC3.13
MUX_MOSI  (via drill 0.6)
  Top 0.406: R21.1 68.14,15.88 69.41,14.61 v82.11,14.61
  Bottom 0.406: v82.11,14.61 IC2.3
MUX_SCLK  (via drill 0.6)
  Top 0.406: R20.1 v71.31,18.41
  Bottom 0.406: v71.31,18.41 71.94,17.78 71.94,15.24 73.85,13.34 IC2.13
N$1
  Top 0.406: C3.1 32.89,31.43 33.68,30.64 IC1.9
N$2
  Top 0.406: IC1.28 38.88,15.92 39.56,15.24 47.18,15.24 47.81,15.88 47.81,17.78 48.45,18.41 R1.1
N$3
  Top 0.406: IC1.27 38.23,15.3 38.92,14.61 47.81,14.61 49.09,15.88 R2.1
N$4
  Top 0.406: IC1.25 36.93,14.06 37.66,13.34 47.81,13.34 48.45,12.7 48.45,11.43 49.09,10.79 R3.1
N$5
  Top 0.406: IC1.26 37.58,14.68 38.29,13.97 48.45,13.97 49.09,13.34 R4.1
N$6
  Top 0.406: IC1.24 36.28,13.44 37.02,12.7 47.18,12.7 47.81,12.06 47.81,8.89 48.45,8.26 R5.1
N$7
  Top 0.406: IC1.23 35.63,12.82 36.38,12.06 46.55,12.06 47.18,11.43 47.18,6.35 47.81,5.71 R6.1
N$8
  Top 0.406: R7.1 45.27,20.95 44.64,21.59 44.64,26.67 44.01,27.3 40.2,27.3 36.93,24.04 IC1.4
N$10
  Top 0.406: IC4.11 98.61,16.51 99.25,15.88 99.25,12.7 99.89,12.06 129.09,12.06 129.73,12.7 SW_#CS.4
  Bottom 0.406: R16.1 SW_#CS.4
N$12
  Top 0.406: IC4.10 99.25,17.78 99.89,17.14 99.89,13.34 100.52,12.7 127.83,12.7 128.46,13.34 128.46,14.61 129.09,15.24 131.63,15.24 132.27,14.61 SW_#CS.2
  Bottom 0.406: R17.1 SW_#CS.2
N$16
  Bottom 0.406: IC2.10 76.39,9.53 78.93,6.99 IC3.10 89.72,6.99 92.27,4.45 113.86,4.45 114.49,5.08 114.49,14.61 115.12,15.24 118.94,15.24 119.57,14.61 SW_SPI.2 R12.1
N$17
  Bottom 0.406: IC2.9 76.39,8.26 78.93,5.71 IC3.9 89.72,5.71 91.63,3.81 114.49,3.81 115.12,4.45 115.12,13.34 115.76,13.97 SW_SPI.4 R13.1
N$18
  Top 0.406: IC4.14 126.56,16.51 127.19,15.88 SW_#CS.6
  Bottom 0.406: R18.1 SW_#CS.6
N$24
  Top 0.406: IC4.13 124.02,15.24 124.65,14.61 SW_#CS.8
  Bottom 0.406: R19.1 SW_#CS.8
PA0
  Top 0.406: EK-TM4C1294XL.74 95.44,52.67 95.44,47.59 JP3.73
PA1
  Top 0.406: EK-TM4C1294XL.76 97.98,52.67 97.98,47.59 JP3.75
PA2  (via drill 0.6)
  Top 0.406: EK-TM4C1294XL.6 9.08,52.67 9.08,47.59 JP3.5 | v53.53,36.2 66.23,23.5 v70.04,23.5
  Bottom 0.406: JP3.5 10.35,45.09 15.43,40.01 49.72,40.01 v53.53,36.2 | IC2.12 73.85,12.06 70.04,15.88 v70.04,23.5
PA3  (via drill 0.6)
  Top 0.406: EK-TM4C1294XL.8 11.62,52.67 11.62,47.59 JP3.7 12.89,45.09 19.88,38.1 64.33,38.1 66.87,35.56 82.11,35.56 86.55,31.11 v87.19,31.11 | IC4.9 91.63,19.05 v87.19,23.5
  Bottom 0.406: v87.19,23.5 v87.19,31.11
PA4  (via drill 0.6)
  Top 0.406: EK-TM4C1294XL.10 14.16,52.67 14.16,47.59 JP3.9 | v77.66,28.57 63.69,28.57 v56.07,36.2
  Bottom 0.406: JP3.9 15.43,45.09 19.24,41.27 50.99,41.27 v56.07,36.2 | IC2.1 81.47,18.25 81.47,24.77 v77.66,28.57
PA5  (via drill 0.6)
  Top 0.406: EK-TM4C1294XL.12 16.7,52.67 16.7,47.59 JP3.11 | v82.74,29.84 63.69,29.84 v57.34,36.2
  Bottom 0.406: JP3.11 17.97,45.09 21.14,41.91 51.62,41.91 v57.34,36.2 | IC3.12 86.55,9.53 85.28,10.79 85.28,21.59 84.64,22.23 84.64,27.94 v82.74,29.84
PA6
  Bottom 0.406: EK-TM4C1294XL.25 JP3.26
PA7
  Bottom 0.406: EK-TM4C1294XL.27 JP3.28
PB0
  Top 0.406: EK-TM4C1294XL.58 75.12,52.67 75.12,47.59 JP3.57
PB1
  Top 0.406: EK-TM4C1294XL.60 77.66,52.67 77.66,47.59 JP3.59
PB2
  Bottom 0.406: EK-TM4C1294XL.67 JP3.68
PB3
  Bottom 0.406: EK-TM4C1294XL.69 JP3.70
PB4  (via drill 0.6)
  Top 0.406: v11.62,45.09 19.24,37.47 63.69,37.47 66.23,34.92 81.47,34.92 87.19,29.21 87.19,24.77 91.63,20.32 IC4.8
  Bottom 0.406: EK-TM4C1294XL.5 JP3.6 11.62,47.59 v11.62,45.09
PB5  (via drill 0.6)
  Top 0.406: v54.8,36.2 66.23,24.77 v71.94,24.77
  Bottom 0.406: EK-TM4C1294XL.7 JP3.8 14.16,47.59 14.16,45.09 18.61,40.64 50.35,40.64 v54.8,36.2 | IC2.14 73.85,14.61 72.58,15.88 72.58,24.13 v71.94,24.77
PC4  (via drill 0.6)
  Top 0.406: v34.48,45.09 36.38,43.18 69.41,43.18 71.94,40.64 87.19,40.64 88.45,39.37 v91,39.37 | IC4.5 92.9,24.13 v91,26.04
  Bottom 0.406: EK-TM4C1294XL.23 JP3.24 34.48,47.59 v34.48,45.09 | v91,26.04 v91,39.37
PC5  (via drill 0.6)
  Top 0.406: v31.94,45.09 34.48,42.55 68.77,42.55 71.31,40.01 86.55,40.01 88.45,38.1 v92.27,38.1 | IC4.4 93.53,25.4 v92.27,26.67
  Bottom 0.406: EK-TM4C1294XL.21 JP3.22 31.94,47.59 v31.94,45.09 | v92.27,26.67 v92.27,38.1
PC6  (via drill 0.6)
  Top 0.406: v29.4,45.09 32.58,41.91 68.14,41.91 70.67,39.37 85.92,39.37 88.45,36.83 v93.53,36.83 | IC4.3 94.17,26.67 v93.53,27.3
  Bottom 0.406: EK-TM4C1294XL.19 JP3.20 29.4,47.59 v29.4,45.09 | v93.53,27.3 v93.53,36.83
PC7  (via drill 0.6)
  Top 0.406: v26.86,45.09 30.67,41.27 67.5,41.27 70.04,38.73 85.28,38.73 88.45,35.56 v94.81,35.56 | IC4.2 v94.81,27.94
  Bottom 0.406: EK-TM4C1294XL.17 JP3.18 26.86,47.59 v26.86,45.09 | v94.81,27.94 v94.81,35.56
PD0  (via drill 0.6)
  Top 0.406: EK-TM4C1294XL.50 64.96,52.67 64.96,47.59 JP3.49 | v81.47,33.66 v67.5,33.66
  Bottom 0.406: IC3.15 87.19,13.34 86.55,13.97 86.55,22.86 85.92,23.5 85.92,29.21 v81.47,33.66 | v67.5,33.66 66.23,34.92 JP3.49
PD1  (via drill 0.6)
  Top 0.406: EK-TM4C1294XL.48 62.42,52.67 62.42,47.59 JP3.47 | v80.2,27.3 v67.5,27.3
  Bottom 0.406: IC2.2 81.47,15.88 82.11,16.51 82.11,25.4 v80.2,27.3 | JP3.47 63.69,31.11 v67.5,27.3
PD2  (via drill 0.6)
  Top 0.406: EK-TM4C1294XL.52 67.5,52.67 67.5,47.59 JP3.51 68.77,45.09 72.58,41.27 87.82,41.27 v88.45,40.64 | IC4.7 91.63,21.59 v88.45,24.77
  Bottom 0.406: v88.45,24.77 v88.45,40.64
PD3  (via drill 0.6)
  Top 0.406: EK-TM4C1294XL.46 59.88,52.67 59.88,47.59 JP3.45 | v72.58,26.04 v66.23,26.04
  Bottom 0.406: IC2.15 73.85,15.88 73.22,16.51 73.22,25.4 v72.58,26.04 | v66.23,26.04 61.15,31.11 JP3.45
PD4
  Top 0.406: EK-TM4C1294XL.40 52.26,52.67 52.26,47.59 JP3.39
PD5
  Top 0.406: EK-TM4C1294XL.38 49.72,52.67 49.72,47.59 JP3.37
PD6
  Top 0.406: EK-TM4C1294XL.44 57.34,52.67 57.34,47.59 JP3.43
PD7
  Top 0.406: EK-TM4C1294XL.42 54.8,52.67 54.8,47.59 JP3.41
PE0
  Top 0.406: EK-TM4C1294XL.14 19.24,52.67 19.24,47.59 JP3.13
PE1
  Top 0.406: EK-TM4C1294XL.16 21.78,52.67 21.78,47.59 JP3.15
PE2
  Top 0.406: EK-TM4C1294XL.18 24.32,52.67 24.32,47.59 JP3.17
PE3
  Top 0.406: EK-TM4C1294XL.20 26.86,52.67 26.86,47.59 JP3.19
PE4  (via drill 0.6)
  Top 0.406: EK-TM4C1294XL.22 29.4,52.67 29.4,47.59 JP3.21 | v78.93,31.11 63.69,31.11 v58.61,36.2
  Bottom 0.406: IC2.5 82.11,12.06 84.01,13.97 84.01,20.32 83.38,20.95 83.38,26.67 v78.93,31.11 | JP3.21 30.67,45.09 33.21,42.55 52.26,42.55 v58.61,36.2
PE5  (via drill 0.6)
  Top 0.406: EK-TM4C1294XL.24 31.94,52.67 31.94,47.59 JP3.23 | v81.47,32.38 63.69,32.38 v59.88,36.2
  Bottom 0.406: JP3.23 33.21,45.09 35.11,43.18 52.9,43.18 v59.88,36.2 | IC3.14 87.19,12.06 85.92,13.34 85.92,22.23 85.28,22.86 85.28,28.57 v81.47,32.38
PF0
  Top 0.406: EK-TM4C1294XL.66 85.28,52.67 85.28,47.59 JP3.65
PF1
  Top 0.406: EK-TM4C1294XL.68 87.82,52.67 87.82,47.59 JP3.67
PF2
  Top 0.406: EK-TM4C1294XL.70 90.36,52.67 90.36,47.59 JP3.69
PF3
  Top 0.406: EK-TM4C1294XL.72 92.9,52.67 92.9,47.59 JP3.71
PF4
  Top 0.406: EK-TM4C1294XL.64 82.74,52.67 82.74,47.59 JP3.63
PG0
  Bottom 0.406: EK-TM4C1294XL.31 JP3.32
PG1
  Bottom 0.406: EK-TM4C1294XL.29 JP3.30
PH0  (via drill 0.6)
  Top 0.406: v16.7,45.09 23.05,38.73 64.96,38.73 67.5,36.2 82.74,36.2 86.55,32.38 96.71,32.38 98.61,34.29 108.14,34.29 108.78,33.66 108.78,28.57 108.14,27.94 IC4.23
  Bottom 0.406: EK-TM4C1294XL.9 JP3.10 16.7,47.59 v16.7,45.09
PH1  (via drill 0.6)
  Top 0.406: v19.24,45.09 24.95,39.37 65.59,39.37 68.14,36.83 83.38,36.83 87.19,33.02 96.08,33.02 97.98,34.92 108.78,34.92 109.41,34.29 109.41,27.3 108.78,26.67 IC4.22
  Bottom 0.406: EK-TM4C1294XL.11 JP3.12 19.24,47.59 v19.24,45.09
PH2  (via drill 0.6)
  Top 0.406: v21.78,45.09 26.86,40.01 66.23,40.01 68.77,37.47 84.01,37.47 87.82,33.66 95.44,33.66 97.34,35.56 109.41,35.56 110.05,34.92 110.05,26.04 109.41,25.4 IC4.21
  Bottom 0.406: EK-TM4C1294XL.13 JP3.14 21.78,47.59 v21.78,45.09
PH3  (via drill 0.6)
  Top 0.406: v24.32,45.09 28.77,40.64 66.87,40.64 69.41,38.1 84.64,38.1 88.45,34.29 94.81,34.29 96.71,36.2 110.05,36.2 110.68,35.56 110.68,24.77 110.05,24.13 IC4.20
  Bottom 0.406: EK-TM4C1294XL.15 JP3.16 24.32,47.59 v24.32,45.09
PJ0  (via drill 0.6)
  Top 0.406: EK-TM4C1294XL.82 105.6,52.67 105.6,47.59 JP3.81 | IC4.19 110.68,22.86 111.31,23.5 111.31,36.2 110.68,36.83 107.5,36.83 v106.87,37.47
  Bottom 0.406: v106.87,37.47 JP3.81
PJ1  (via drill 0.6)
  Top 0.406: EK-TM4C1294XL.84 108.14,52.67 108.14,47.59 JP3.83 | IC4.18 111.31,21.59 111.95,22.23 111.95,36.83 111.31,37.47 110.05,37.47 v109.41,38.1
  Bottom 0.406: v109.41,38.1 JP3.83
PK0
  Top 0.406: EK-TM4C1294XL.26 34.48,52.67 34.48,47.59 JP3.25
PK1
  Top 0.406: EK-TM4C1294XL.28 37.02,52.67 37.02,47.59 JP3.27
PK2
  Top 0.406: EK-TM4C1294XL.30 39.56,52.67 39.56,47.59 JP3.29
PK3
  Top 0.406: EK-TM4C1294XL.32 42.1,52.67 42.1,47.59 JP3.31
PK4
  Bottom 0.406: EK-TM4C1294XL.77 JP3.78
PK5
  Bottom 0.406: EK-TM4C1294XL.75 JP3.76
PK6
  Bottom 0.406: EK-TM4C1294XL.63 JP3.64
PK7
  Bottom 0.406: EK-TM4C1294XL.59 JP3.60
PL0
  Bottom 0.406: EK-TM4C1294XL.43 JP3.44
PL1
  Bottom 0.406: EK-TM4C1294XL.45 JP3.46
PL2
  Bottom 0.406: EK-TM4C1294XL.47 JP3.48
PL3
  Bottom 0.406: EK-TM4C1294XL.49 JP3.50
PL4
  Bottom 0.406: EK-TM4C1294XL.65 JP3.66
PL5
  Bottom 0.406: EK-TM4C1294XL.79 JP3.80
PM0
  Bottom 0.406: EK-TM4C1294XL.41 JP3.42
PM1
  Bottom 0.406: EK-TM4C1294XL.39 JP3.40
PM2
  Bottom 0.406: EK-TM4C1294XL.37 JP3.38
PM3
  Bottom 0.406: EK-TM4C1294XL.33 JP3.34
PM4
  Top 0.406: EK-TM4C1294XL.92 118.3,52.67 118.3,47.59 JP3.91
PM5
  Top 0.406: EK-TM4C1294XL.90 115.76,52.67 115.76,47.59 JP3.89
PM6
  Top 0.406: EK-TM4C1294XL.88 113.22,52.67 113.22,47.59 JP3.87
PM7
  Top 0.406: EK-TM4C1294XL.86 110.68,52.67 110.68,47.59 JP3.85
PN0
  Bottom 0.406: EK-TM4C1294XL.85 JP3.86
PN1
  Bottom 0.406: EK-TM4C1294XL.87 JP3.88
PN2
  Bottom 0.406: EK-TM4C1294XL.89 JP3.90
PN3
  Bottom 0.406: EK-TM4C1294XL.91 JP3.92
PN4
  Bottom 0.406: EK-TM4C1294XL.81 JP3.82
PN5
  Bottom 0.406: EK-TM4C1294XL.83 JP3.84
PP0
  Top 0.406: EK-TM4C1294XL.54 70.04,52.67 70.04,47.59 JP3.53 71.31,45.09 74.48,41.91 88.45,41.91 89.72,40.64 111.95,40.64 112.58,40.01 112.58,20.95 111.95,20.32 IC4.17
PP1
  Top 0.406: EK-TM4C1294XL.56 72.58,52.67 72.58,47.59 JP3.55 73.85,45.09 75.75,43.18 112.58,43.18 113.22,42.55 113.22,19.68 112.58,19.05 IC4.16
PP2
  Bottom 0.406: EK-TM4C1294XL.71 JP3.72
PP3
  Bottom 0.406: EK-TM4C1294XL.73 JP3.74
PP4
  Top 0.406: EK-TM4C1294XL.78 100.52,52.67 100.52,47.59 JP3.77
PP5
  Top 0.406: EK-TM4C1294XL.80 103.06,52.67 103.06,47.59 JP3.79
PQ0
  Bottom 0.406: EK-TM4C1294XL.51 JP3.52 70.04,47.59 70.04,45.72 68.77,44.45 68.77,15.88 73.85,10.79 IC2.11
PQ1  (via drill 0.6)
  Top 0.406: IC4.6 92.27,22.86 v89.72,25.4 | v72.58,45.09 75.12,42.55 89.09,42.55 v89.72,41.91
  Bottom 0.406: EK-TM4C1294XL.53 JP3.54 72.58,47.59 v72.58,45.09 | v89.72,41.91 v89.72,25.4
PQ2
  Bottom 0.406: EK-TM4C1294XL.55 JP3.56 75.12,47.59 75.12,33.66 82.74,26.04 82.74,20.32 83.38,19.68 83.38,14.61 82.11,13.34 IC2.4
PQ3
  Bottom 0.406: EK-TM4C1294XL.57 JP3.58 77.66,47.59 77.66,33.66 84.01,27.3 84.01,21.59 84.64,20.95 84.64,10.16 86.55,8.26 IC3.11
PQ4
  Bottom 0.406: EK-TM4C1294XL.93 JP3.94
REFN0  (via drill 0.6)
  Top 0.406: IC1.6 35.63,25.91 v36.38,26.67
  Bottom 0.406: v36.38,26.67 37.02,27.3 37.02,31.75 36.07,32.7 C15.2 26.22,33.34 C14.1 24.32,31.43 R15.2
REFN1  (via drill 0.6)
  Top 0.406: IC1.8 34.33,28.43 v35.11,29.21
  Bottom 0.406: v35.11,29.21 30.99,25.09 C12.2 26.22,24.45 C11.1 24.32,26.35 R27.2
REFP0  (via drill 0.6)
  Top 0.406: IC1.5 36.28,24.66 v37.02,25.4
  Bottom 0.406: v37.02,25.4 37.66,26.04 37.66,34.92 36.7,35.88 C13.1 26.22,35.24 C14.2 24.32,37.15 R14.2
REFP1  (via drill 0.6)
  Top 0.406: IC1.7 34.98,27.17 v35.75,27.94
  Bottom 0.406: v35.75,27.94 29.71,21.91 C10.1 26.22,22.55 C11.2 24.32,20.64 R26.2
RESET
  Top 0.406: EK-TM4C1294XL.94 120.84,52.67 120.84,47.59 JP3.93
RTDN0  (via drill 0.6)
  Top 0.406: R9.1 v4.63,25.4 | v4.63,29.21 4.63,33.02 4.12,33.53 PT100-1.4
  Bottom 0.406: v4.63,25.4 v4.63,29.21
RTDN1
  Top 0.406: R11.1 21.91,13.53 PT100-2.4
RTDP0
  Top 0.406: R8.1 2.09,27.94 1.8,28.23 PT100-1.2
RTDP1  (via drill 0.6)
  Top 0.406: R10.1 v4.63,15.24 | v4.63,11.43 4.59,11.47 PT100-2.2
  Bottom 0.406: v4.63,15.24 v4.63,11.43
SCLK
  Top 0.406: R1.2 SCLK.1 R20.2
START
  Top 0.406: R6.2 START.1 R24.2
VREF
  Top 0.406: EK-TM4C1294XL.34 44.64,52.67 44.64,47.59 JP3.33
WAKE
  Bottom 0.406: EK-TM4C1294XL.95 JP3.96

### Text on the board
tNames: Bachelorarbeit von Tim Schaake / Modulares Messsystem - Modul PT100 / Vers. 1.0